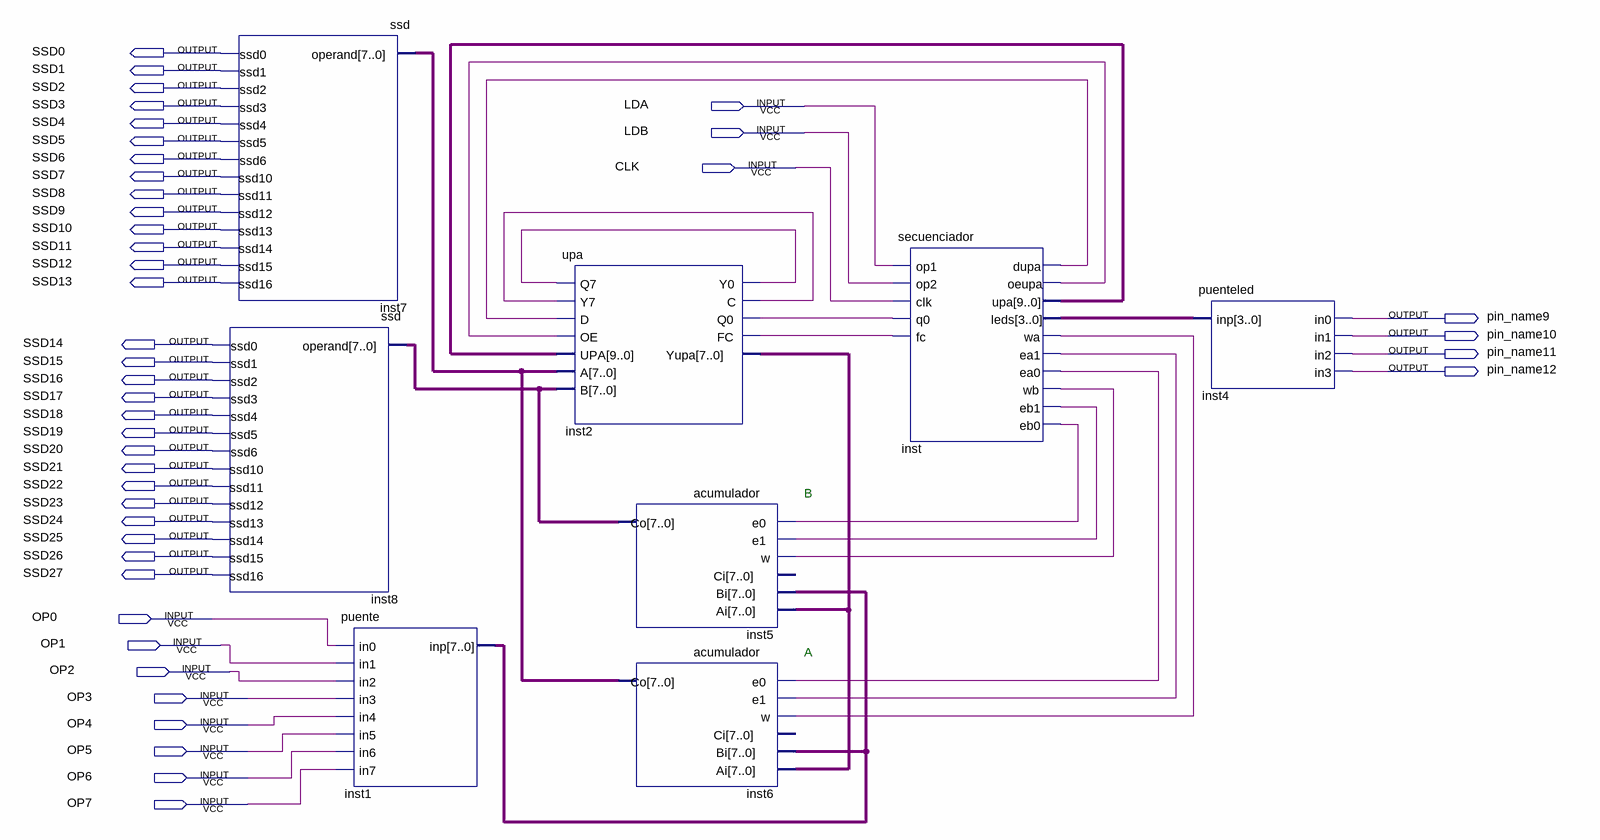
[diagram p0: schematic sheet]
// Quartus schematic Multiplicador.bdf as structural Verilog: 8 symbols, 43 pins
module Multiplicador (
  input  LDA,
  input  LDB,
  input  CLK,
  input  OP0,
  input  OP1,
  input  OP2,
  input  OP3,
  input  OP4,
  input  OP5,
  input  OP6,
  input  OP7,
  output SSD0,
  output SSD1,
  output SSD2,
  output SSD3,
  output SSD4,
  output SSD5,
  output SSD6,
  output SSD7,
  output SSD8,
  output SSD9,
  output SSD10,
  output SSD11,
  output SSD12,
  output SSD13,
  output pin_name9,
  output pin_name10,
  output SSD14,
  output pin_name11,
  output SSD15,
  output pin_name12,
  output SSD16,
  output SSD17,
  output SSD18,
  output SSD19,
  output SSD20,
  output SSD21,
  output SSD22,
  output SSD23,
  output SSD24,
  output SSD25,
  output SSD26,
  output SSD27
);

  wire inst2_c, inst2_fc, inst2_q0, inst2_y0, inst_dupa, inst_ea0, inst_ea1, inst_eb0, inst_eb1, inst_oeupa,
       inst_wa, inst_wb;
  wire [3:0] inst_leds;
  wire [7:0] inst1_inp, inst2_yupa, inst5_co, inst6_co;
  wire [9:0] inst_upa;

  ssd inst7 (
    .operand(inst6_co), .ssd0(SSD0), .ssd1(SSD1), .ssd2(SSD2), .ssd3(SSD3), .ssd4(SSD4), .ssd5(SSD5),
    .ssd6(SSD6), .ssd10(SSD7), .ssd11(SSD8), .ssd12(SSD9), .ssd13(SSD10), .ssd14(SSD11), .ssd15(SSD12),
    .ssd16(SSD13));
  ssd inst8 (
    .operand(inst5_co), .ssd0(SSD14), .ssd1(SSD15), .ssd2(SSD16), .ssd3(SSD17), .ssd4(SSD18), .ssd5(SSD19),
    .ssd6(SSD20), .ssd10(SSD21), .ssd11(SSD22), .ssd12(SSD23), .ssd13(SSD24), .ssd14(SSD25), .ssd15(SSD26),
    .ssd16(SSD27));
  puente inst1 (
    .in0(OP0), .in1(OP1), .in2(OP2), .in3(OP3), .in4(OP4), .in5(OP5), .in6(OP6), .in7(OP7), .inp(inst1_inp));
  upa inst2 (
    .Q7(inst2_y0), .Y7(inst2_c), .D(inst_dupa), .OE(inst_oeupa), .UPA(inst_upa), .A(inst6_co), .B(inst5_co),
    .Y0(inst2_y0), .C(inst2_c), .Q0(inst2_q0), .FC(inst2_fc), .Yupa(inst2_yupa));
  acumulador inst5 (
    .e0(inst_eb0), .e1(inst_eb1), .w(inst_wb), .Bi(inst1_inp), .Ai(inst2_yupa), .Co(inst5_co));  // open: Ci
  acumulador inst6 (
    .e0(inst_ea0), .e1(inst_ea1), .w(inst_wa), .Bi(inst1_inp), .Ai(inst2_yupa), .Co(inst6_co));  // open: Ci
  secuenciador inst (
    .op1(LDA), .op2(LDB), .clk(CLK), .q0(inst2_q0), .fc(inst2_fc), .dupa(inst_dupa), .oeupa(inst_oeupa),
    .upa(inst_upa), .leds(inst_leds), .wa(inst_wa), .ea1(inst_ea1), .ea0(inst_ea0), .wb(inst_wb),
    .eb1(inst_eb1), .eb0(inst_eb0));
  puenteled inst4 (.inp(inst_leds), .in0(pin_name9), .in1(pin_name10), .in2(pin_name11), .in3(pin_name12));

  // Notes on the sheet:
  //   B
  //   A
endmodule
